# Altium project Quarter Bridge Strain Gauge.PrjPcb
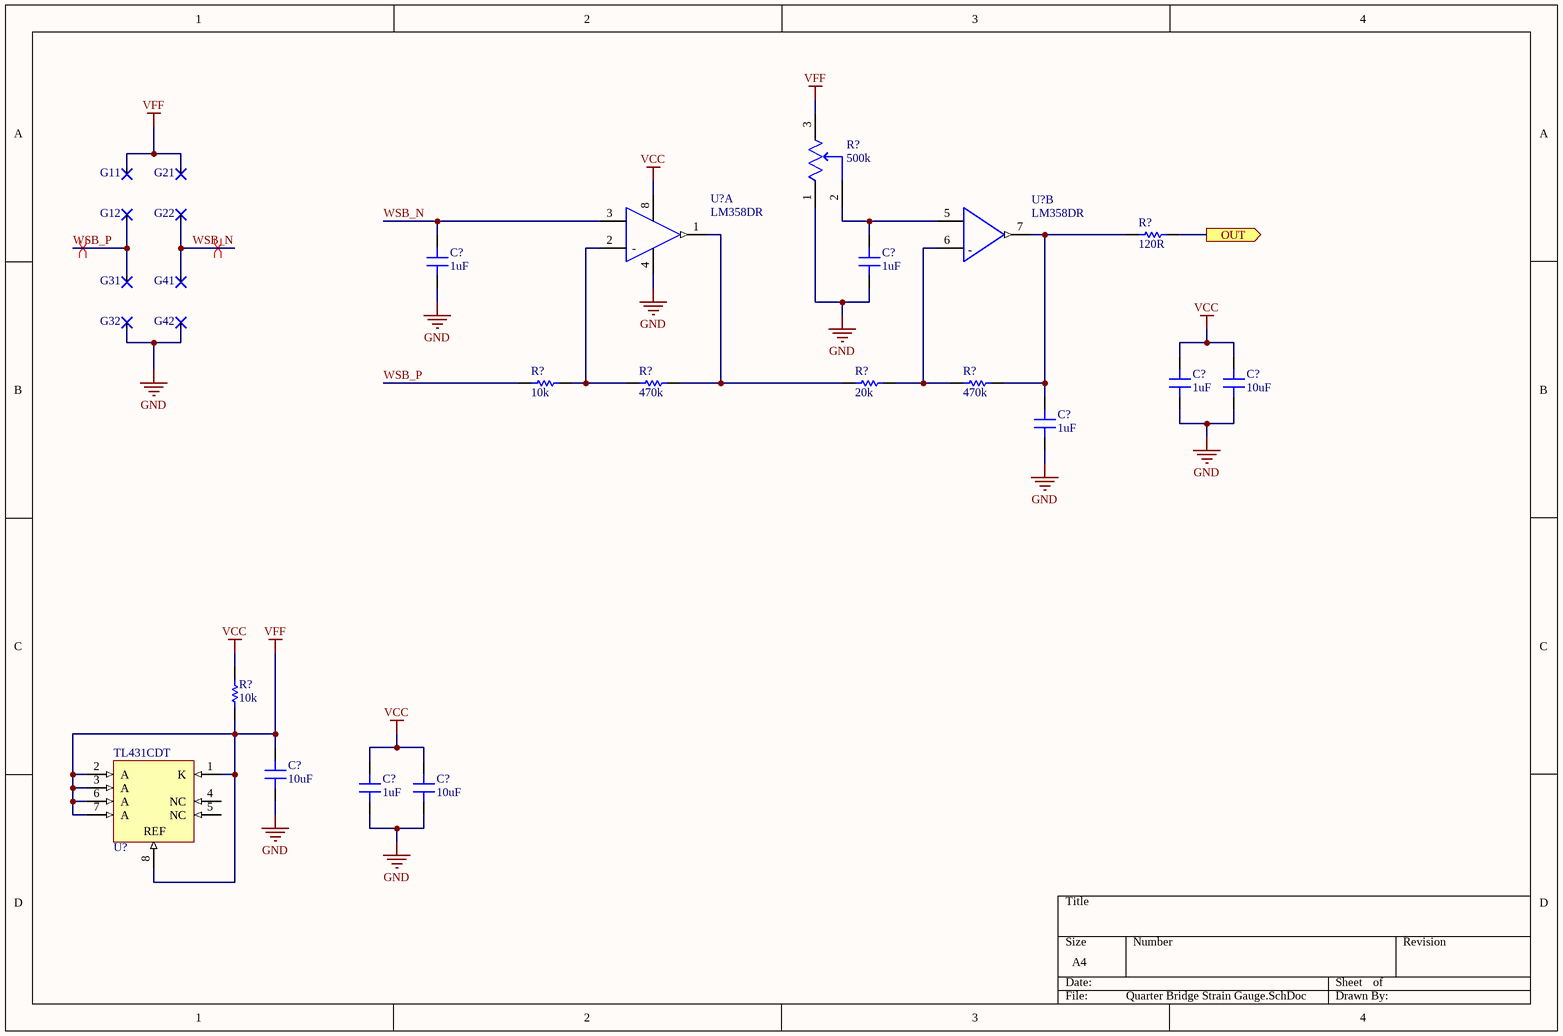
[diagram p0: Quarter Bridge Strain Gauge.SchDoc]
1 sheet, 26 parts. Net scope: flat (ports and power ports of the same name join across sheets).

## Sheet Quarter Bridge Strain Gauge.SchDoc
size A4; SheetNumber: 1; SheetTotal: 1

### Parts
(Parts that share a designator on the sheet are numbered #1, #2 ... from top to bottom, then left to right.)
C?#1  1uF  [0805]
C?#2  1uF  [0805]
C?#3  1uF  [0805]
C?#4  10uF  [0805]
C?#5  1uF  [0805]
C?#6  10uF  [0805]
C?#7  1uF  [0805]
C?#8  10uF  [0805]
G11  Rectangular  [2.5x5mm]  (value not drawn)
G12  Rectangular  [2.5x5mm]  (value not drawn)
G21  Rectangular  [2.5x5mm]  (value not drawn)
G22  Rectangular  [2.5x5mm]  (value not drawn)
G31  Rectangular  [2.5x5mm]  (value not drawn)
G32  Rectangular  [2.5x5mm]  (value not drawn)
G41  Rectangular  [2.5x5mm]  (value not drawn)
G42  Rectangular  [2.5x5mm]  (value not drawn)
R?#1  500k  [FP-3296W-MFG]
R?#2  120R  [0805]
R?#3  10k  [0805]
R?#4  470k  [0805]
R?#5  20k  [0805]
R?#6  470k  [0805]
R?#7  10k  [0805]
U?#1  LM358DR  [FP-D0008A-MFG]  (part A of 2)
U?#2  LM358DR  [FP-D0008A-MFG]  (part B of 2)
U?#3  TL431CDT  [SO8_M]

### Ports
OUT (out)

### Nets
GND: C?#1.1 C?#2.1 C?#3.1 C?#4.1 C?#5.1 C?#6.1 C?#7.1 C?#8.1 G32.1 G42.1 R?#1.1(CCW) U?#1.4(V-)
VCC: C?#3.2 C?#4.2 C?#7.2 C?#8.2 R?#7.1 U?#1.8(V+)
VFF: C?#6.2 G11.1 G21.1 R?#1.3(CW) R?#7.2 U?#3.1(K) U?#3.2(A) U?#3.3(A) U?#3.6(A) U?#3.7(A) U?#3.8(REF)
WSB_N: C?#1.2 G22.1 G41.1 U?#1.3(IN1+)
WSB_P: G12.1 G31.1 R?#3.2
NetC?#2_2: C?#2.2 R?#1.2(WIPER) U?#2.5(IN2+)
NetC?#5_2: C?#5.2 R?#2.2 R?#6.1 U?#2.7(2OUT)
NetR?#2_1: R?#2.1 ; port OUT
NetR?#3_1: R?#3.1 R?#4.2 U?#1.2(IN1-)
NetR?#4_1: R?#4.1 R?#5.2 U?#1.1(1OUT)
NetR?#5_1: R?#5.1 R?#6.2 U?#2.6(IN2-)

Not connected (* = marked no-connect by the designer): U?#3 4(NC) 5(NC)

### Layout directives
differential pair: WSB_N, WSB_P

### Notes on the sheet
- (in symbol CMP-1685-00009-2, part A) -
- (in symbol CMP-1685-00009-2, part B) -

### Library data of the parts
C?#1-C?#8 = Capacitor - Ceramic
  C?#1-C?#3 C?#5 C?#7: Value: 1uF
  C?#4 C?#6 C?#8: Value: 10uF
R?#1 = CMP-2000-05583-2: TRIMMER 500K OHM 0.5W PC PIN TOP / 3296W-1-504LF; Manufacturer: Bourns; Description: 500 kOhms 0.5W, 1/2W PC Pins Through Hole Trimmer Potentiometer Cermet 25 Turn Top Adjustment; Resistance: 500kΩ; Temperature Coefficient: 100ppm/°C; Value: 500kΩ; Tolerance: 10%; Voltage Rating: 300V; Standoff Height: 0.38mm; Number of Turns: 25; Max Power Dissipation: 500mW; ComponentLink2Description: Datasheet; Package: 3296W; Series: Trimpot 3296-Sealed; Lead Free: Yes; Octopart: https://octopart.com/3296w-1-504lf-bourns-143884; Device Class L2: Resistors; Automotive: No; RoHS: TRUE; Temperature Range High: +125°C; Manufacturer Part Number: 3296W-1-504LF; Height: 12.05mm; Power Rating: 0.5W; Temperature Range Low: -55°C; ComponentLink2URL: https://www.bourns.com/docs/Product-Datasheets/3296.pdf; Device Class L1: Passive Components; Device Class L3: Variable Resistors and Potentiometers; Category: Res; Temperature: -55°C to +125°C; Digikey Description: TRIMMER 500K OHM 0.5W PC PIN TOP; Mouser Description: Trimmer; Cermet; Rest 500 Kilohms; PCB; 25 Turns; Pwr-Rtg 0.5W; Supplier 1: Digi-Key; Supplier Part Number 1: 3296W-504LF-ND; Stock 1: 2984; Pricing 1: 1=2.41000, 10=2.11700, 25=1.89800, 50=1.82500, 100=1.75200, 250=1.67900, 500=1.38700, 1000=1.31400, 5000=1.09500 (USD); Mount: Panel,Through Hole,PCB; Weight: 0.03oz; Color: Blue; Contact Plating: Tin,Matte; Min Operating Temperature: -55°C; Max Operating Temperature: 125°C; Resistor Type: Cermet; Packaging: Rail/Tube; Termination: Pin; Taper: Linear; Package Quantity: 50; Resistance Tolerance: 10%; Technology: CERMET; Length: 9.53mm; Width: 9.53mm; Depth: 4.83mm; Radiation Hardening: No; REACH SVHC: No SVHC; Military Standard: Not; ComponentLink1URL: https://datasheet.ciiva.com/11832/0900766b8069ccf4-11832237.pdf?src-supplier=RSComponents; ComponentLink1Description: https://datasheet.ciiva.com/11832/0900766b8069ccf4-11832237.pdf?src-supplier=RSComponents; ComponentLink3URL: https://datasheet.ciiva.com/19466/853812-19466623.pdf?src-supplier=Jameco; ComponentLink3Description: https://datasheet.ciiva.com/19466/853812-19466623.pdf?src-supplier=Jameco; ComponentLink4URL: https://datasheet.ciiva.com/29122/447286-da-01-en-trimmer-tht-3296w-1-504lf-500k-0-5w-29122370.pdf?src-supplier=Conrad; ComponentLink4Description: https://datasheet.ciiva.com/29122/447286-da-01-en-trimmer-tht-3296w-1-504lf-500k-0-5w-29122370.pdf?src-supplier=Conrad; ComponentLink5URL: https://datasheet.ciiva.com/3266/3296-3266198.pdf?src-supplier=Avnet; ComponentLink5Description: https://datasheet.ciiva.com/3266/3296-3266198.pdf?src-supplier=Avnet; ComponentLink6URL: https://datasheet.ciiva.com/2156/3296-2156894.pdf?src-supplier=Digi-Key; ComponentLink6Description: https://datasheet.ciiva.com/2156/3296-2156894.pdf?src-supplier=Digi-Key; ComponentLink7URL: https://datasheet.ciiva.com/30196/3296-30196060.pdf?src-supplier=Onlinecomponents.com; ComponentLink7Description: https://datasheet.ciiva.com/30196/3296-30196060.pdf?src-supplier=Onlinecomponents.com; ComponentLink8URL: https://datasheet.ciiva.com/16819/3296-16819127.pdf?src-supplier=Avnet+Europe; ComponentLink8Description: https://datasheet.ciiva.com/16819/3296-16819127.pdf?src-supplier=Avnet+Europe; ComponentLink9URL: https://datasheet.ciiva.com/16715/70153578-16715020.pdf?src-supplier=Allied+Electronics; ComponentLink9Description: https://datasheet.ciiva.com/16715/70153578-16715020.pdf?src-supplier=Allied+Electronics; ComponentLink10URL: https://datasheet.ciiva.com/15156/getdatasheetpartid-27989-15156235.pdf?src-supplier=Verical; ComponentLink10Description: https://datasheet.ciiva.com/15156/getdatasheetpartid-27989-15156235.pdf?src-supplier=Verical; ComponentLink11URL: https://datasheet.ciiva.com/1131/1815117-1131347.pdf?src-supplier=Element14; ComponentLink11Description: https://datasheet.ciiva.com/1131/1815117-1131347.pdf?src-supplier=Element14; Supplier 2: LCSC; Supplier Part Number 2: C83694; Stock 2: 3160; Pricing 2: 1=5.50620, 10=4.20990, 30=3.96600, 100=3.73500, 500=3.61950, 1000=3.56810, 1=5.32020, 10=4.06760, 30=3.83200, 100=3.60880, 500=3.49720, 1000=3.44760, 1=27.82880, 10=21.27700, 30=20.04450, 100=18.87690, 500=18.29310, 1000=18.03360, 1=26.42210, 10=20.20150, 30=19.03130, 100=17.92270, 500=17.36840, 1000=17.12200, 1=3.55350, 10=2.71690, 30=2.55950, 100=2.41040, 500=2.33590, 1000=2.30280, 1=3.08890, 10=2.36170, 30=2.22490, 100=2.09530, 500=2.03050, 1000=2.00170, 1=33.29660, 10=25.45760, 30=23.98290, 100=22.58580, 500=21.88730, 1000=21.57680, 1=464.54270, 10=355.17480, 30=334.60070, 100=315.10940, 500=305.36370, 1000=301.03230, 1=17.58470, 10=13.44470, 30=12.66590, 100=11.92810, 500=11.55920, 1000=11.39520, 1=321.67490, 10=245.94260, 30=231.69590, 100=218.19910, 500=211.45070, 1000=208.45140, 1=35.97980, 10=27.50910, 30=25.91560, 100=24.40590, 500=23.65110, 1000=23.31560, 1=5.69090, 10=4.35110, 30=4.09900, 100=3.86020, 500=3.74080, 1000=3.68780, 1=4.29000, 10=3.28000, 30=3.09000, 100=2.91000, 500=2.82000, 1000=2.78000 (AUD)
R?#2-R?#7 = Resistor
  R?#2: Value: 120R
  R?#3 R?#7: Value: 10k
  R?#4 R?#6: Value: 470k
  R?#5: Value: 20k
U?#1 U?#2 = CMP-1685-00009-2: IC OPAMP GP 2 CIRCUIT 8SOIC; Manufacturer: Texas Instruments; Output Current: 30mA; Min Dual Supply Voltage: 1.5V; Input Offset Voltage (Vos): 7mV; Power Supply Rejection Ratio (PSRR): 65dB; Unity Gain Bandwidth Product: 700kHz; Number of Channels: 2; Min Supply Voltage: 3V; Max Dual Supply Voltage: 16V; Dual Supply Voltage: 9V; Max Supply Voltage: 32V; Nominal Supply Current: 1.2mA; Slew Rate: 0.3V/µs; Input Bias Current: 250nA; Voltage Gain: 100dB; Operating Supply Current: 1mA; Description: TEXAS INSTRUMENTS - LM358DR - OP AMP, DUAL LOW POWER, SOIC8, 358; REACH SVHC: No SVHC; Package Quantity: 2500; Width: 3.91mm; Max Operating Temperature: 70°C; Min Operating Temperature: 0°C; Mount: Surface Mount; Length: 4.9mm; Radiation Hardening: No; Case/Package: SOIC; Lead Free: Lead Free; Number of Elements: 2; Packaging: Tape and Reel; Output Current per Channel: 30mA; Number of Circuits: 2; Bandwidth: 700kHz; Operating Supply Voltage: 16V; Gain Bandwidth Product: 700kHz; Number of Pins: 8; Number of Amplifiers: 2; Height: 1.58mm; Common Mode Rejection Ratio: 65dB; Contact Plating: Gold; Supplier 1: LCSC; Supplier Part Number 1: C5423; Manufacturer Part Number: LM358DR; RoHS: Yes; Category: Amplifiers - Op Amps, Buffer, Instrumentation; Stock 1: 167767; Pricing 1: 1=1.02780, 10=0.75160, 30=0.70090, 100=0.65020, 500=0.62760, 1000=0.61650, 1=0.99310, 10=0.72620, 30=0.67720, 100=0.62820, 500=0.60640, 1000=0.59560, 1=5.19470, 10=3.79870, 30=3.54250, 100=3.28630, 500=3.17210, 1000=3.11570, 1=4.93210, 10=3.60670, 30=3.36340, 100=3.12010, 500=3.01170, 1000=2.95820, 1=0.66330, 10=0.48510, 30=0.45240, 100=0.41960, 500=0.40510, 1000=0.39780, 1=0.57660, 10=0.42160, 30=0.39320, 100=0.36480, 500=0.35210, 1000=0.34580, 1=6.21540, 10=4.54510, 30=4.23850, 100=3.93200, 500=3.79530, 1000=3.72780, 1=86.71460, 10=63.41170, 30=59.13440, 100=54.85720, 500=52.95140, 1000=52.00930, 1=3.28250, 10=2.40040, 30=2.23850, 100=2.07660, 500=2.00440, 1000=1.96870, 1=60.04600, 10=43.90980, 30=40.94790, 100=37.98610, 500=36.66640, 1000=36.01410, 1=6.71620, 10=4.91140, 30=4.58010, 100=4.24880, 500=4.10120, 1000=4.02820, 1=1.06230, 10=0.77680, 30=0.72440, 100=0.67200, 500=0.64870, 1000=0.63710, 1=0.80080, 10=0.58560, 30=0.54610, 100=0.50660, 500=0.48900, 1000=0.48030 (AUD); ComponentLink1URL: https://datasheet.ciiva.com/1795/lm358-1795488.pdf?src-supplier=Digi-Key; ComponentLink1Description: https://datasheet.ciiva.com/1795/lm358-1795488.pdf?src-supplier=Digi-Key; ComponentLink2URL: https://datasheet.ciiva.com/27056/2016330-27056228.pdf?src-supplier=Jameco; ComponentLink2Description: https://datasheet.ciiva.com/27056/2016330-27056228.pdf?src-supplier=Jameco; ComponentLink3URL: https://datasheet.ciiva.com/26847/lm358dr-26847142.pdf?src-supplier=IIIC; ComponentLink3Description: https://datasheet.ciiva.com/26847/lm358dr-26847142.pdf?src-supplier=IIIC; ComponentLink4URL: https://datasheet.ciiva.com/7709/1874566-7709823.pdf?src-supplier=Element14; ComponentLink4Description: https://datasheet.ciiva.com/7709/1874566-7709823.pdf?src-supplier=Element14; ComponentLink5URL: https://datasheet.ciiva.com/46385/1874566-46385851.pdf?src-supplier=Element14; ComponentLink5Description: https://datasheet.ciiva.com/46385/1874566-46385851.pdf?src-supplier=Element14; ComponentLink6URL: https://datasheet.ciiva.com/46390/1874566-46390414.pdf?src-supplier=Element14; ComponentLink6Description: https://datasheet.ciiva.com/46390/1874566-46390414.pdf?src-supplier=Element14; ComponentLink7URL: https://datasheet.ciiva.com/1795/lm358-1795487.pdf?src-supplier=Digi-Key; ComponentLink7Description: https://datasheet.ciiva.com/1795/lm358-1795487.pdf?src-supplier=Digi-Key; ComponentLink8URL: https://datasheet.ciiva.com/1795/lm358-1795489.pdf?src-supplier=Digi-Key; ComponentLink8Description: https://datasheet.ciiva.com/1795/lm358-1795489.pdf?src-supplier=Digi-Key; ComponentLink9URL: https://datasheet.ciiva.com/2973/lm358a-2973386.pdf?src-supplier=Avnet; ComponentLink9Description: https://datasheet.ciiva.com/2973/lm358a-2973386.pdf?src-supplier=Avnet; Supplier 2: Digikey; Supplier Part Number 2: 497-18378-ND
U?#3 = CMP-0242-00034-1: Programmable Voltage Reference, 2.5 to 36V, 8-Pin SO, Tape and Reel; Manufacturer: STMicroelectronics; Description: V REF, 2.495VREF, 0.1A, 2%, 8SOIC; Max Input Voltage: 37V; Tolerance: 2%; Max Output Current: 100mA; Cathode Current: 1mA; Reference Type: Shunt,Adjustable; Temperature Coefficient: 100ppm/°C; Min Output Voltage: 2.5V; Min Input Voltage: 1.24V; Number of Channels: 1; ComponentLink1URL: http://www.st.com; ComponentLink3Description: Package Specification; PackageReference: SO8; PackageDescription: 8-Pin Small Outline Integrated Circuit 1.27 mm Pitch; ComponentLink2Description: Datasheet; ComponentLink3URL: http://www.st.com/internet/com/TECHNICAL_RESOURCES/TECHNICAL_LITERATURE/PACKAGE_INFORMATION/CD00004680.pdf; ComponentLink2URL: http://www.st.com/internet/com/TECHNICAL_RESOURCES/TECHNICAL_LITERATURE/DATASHEET/CD00000986.pdf; Code_IPC: SOIC127P600-8; Code_JEDEC: MS-012-AA; DatasheetVersion: Oct-2011; PackageVersion: Dec-2002; ComponentLink1Description: Manufacturer URL; Supplier 1: Digi-Key; Supplier Part Number 1: 497-3036-1-ND; Manufacturer Part Number: TL431CDT; RoHS: Yes; Category: Voltage References; Stock 1: 15; Pricing 1: 1=0.48000, 10=0.38900, 25=0.35600, 100=0.26490, 250=0.24008, 500=0.19868, 1000=0.14901 (USD); Mount: Surface Mount; Case/Package: SO; Number of Pins: 8; Min Operating Temperature: 0°C; Max Operating Temperature: 70°C; Package Quantity: 1; Packaging: Tape and Reel; Output Voltage: 36V; Output Current: 100mA; Max Output Voltage: 36V; Reference Voltage: 36V; Series: -; Nominal Supply Current: 100mA; Supply Current: 100mA; Termination: SMD/SMT; Length: 4.9mm; Width: 3.9mm; Height: 1.25mm; Radiation Hardening: No; Lead Free: Lead Free; REACH SVHC: No SVHC; RoHS Compliant: Yes; ComponentLink4URL: https://datasheet.ciiva.com/41424/001185140-da-01-en-ic-vref-shunt-prec-a-tl431cdt-soic-8-stm-41424462.pdf?src-supplier=Conrad; ComponentLink4Description: https://datasheet.ciiva.com/41424/001185140-da-01-en-ic-vref-shunt-prec-a-tl431cdt-soic-8-stm-41424462.pdf?src-supplier=Conrad; ComponentLink5URL: https://datasheet.ciiva.com/2006/cd00000986-2006170.pdf?src-supplier=Digi-Key; ComponentLink5Description: https://datasheet.ciiva.com/2006/cd00000986-2006170.pdf?src-supplier=Digi-Key; ComponentLink6URL: https://datasheet.ciiva.com/2006/cd00000986-2006171.pdf?src-supplier=Digi-Key; ComponentLink6Description: https://datasheet.ciiva.com/2006/cd00000986-2006171.pdf?src-supplier=Digi-Key; ComponentLink7URL: https://datasheet.ciiva.com/2006/cd00000986-2006172.pdf?src-supplier=Digi-Key; ComponentLink7Description: https://datasheet.ciiva.com/2006/cd00000986-2006172.pdf?src-supplier=Digi-Key; ComponentLink8URL: https://datasheet.ciiva.com/7630/1690313-7630038.pdf?src-supplier=Element14; ComponentLink8Description: https://datasheet.ciiva.com/7630/1690313-7630038.pdf?src-supplier=Element14; ComponentLink9URL: https://datasheet.ciiva.com/7630/1690313-7630039.pdf?src-supplier=Element14; ComponentLink9Description: https://datasheet.ciiva.com/7630/1690313-7630039.pdf?src-supplier=Element14; ComponentLink10URL: https://datasheet.ciiva.com/22698/1690313-22698678.pdf?src-supplier=Element14; ComponentLink10Description: https://datasheet.ciiva.com/22698/1690313-22698678.pdf?src-supplier=Element14; Supplier 2: LCSC; Supplier Part Number 2: C283418; Stock 2: 438; Pricing 2: 1=1.33870, 10=1.07110, 30=1.02190, 100=0.97280, 500=0.95080, 1000=0.94000, 1=1.29350, 10=1.03490, 30=0.98740, 100=0.93990, 500=0.91870, 1000=0.90830, 1=6.76580, 10=5.41330, 30=5.16490, 100=4.91640, 500=4.80550, 1000=4.75100, 1=6.42380, 10=5.13970, 30=4.90380, 100=4.66790, 500=4.56260, 1000=4.51080, 1=0.86390, 10=0.69120, 30=0.65950, 100=0.62780, 500=0.61360, 1000=0.60670, 1=0.75100, 10=0.60090, 30=0.57330, 100=0.54570, 500=0.53340, 1000=0.52730, 1=8.09520, 10=6.47690, 30=6.17970, 100=5.88240, 500=5.74970, 1000=5.68450, 1=112.94130, 10=90.36380, 30=86.21650, 100=82.06920, 500=80.21750, 1000=79.30790, 1=4.27530, 10=3.42060, 30=3.26360, 100=3.10660, 500=3.03650, 1000=3.00210, 1=78.20670, 10=62.57290, 30=59.70110, 100=56.82920, 500=55.54700, 1000=54.91720, 1=8.74750, 10=6.99890, 30=6.67770, 100=6.35640, 500=6.21300, 1000=6.14260, 1=1.38360, 10=1.10700, 30=1.05620, 100=1.00540, 500=0.98270, 1000=0.97160, 1=1.04300, 10=0.83450, 30=0.79620, 100=0.75790, 500=0.74080, 1000=0.73240 (AUD)